# Altium project AA_CHRISTMAS_TREE.PrjPcb
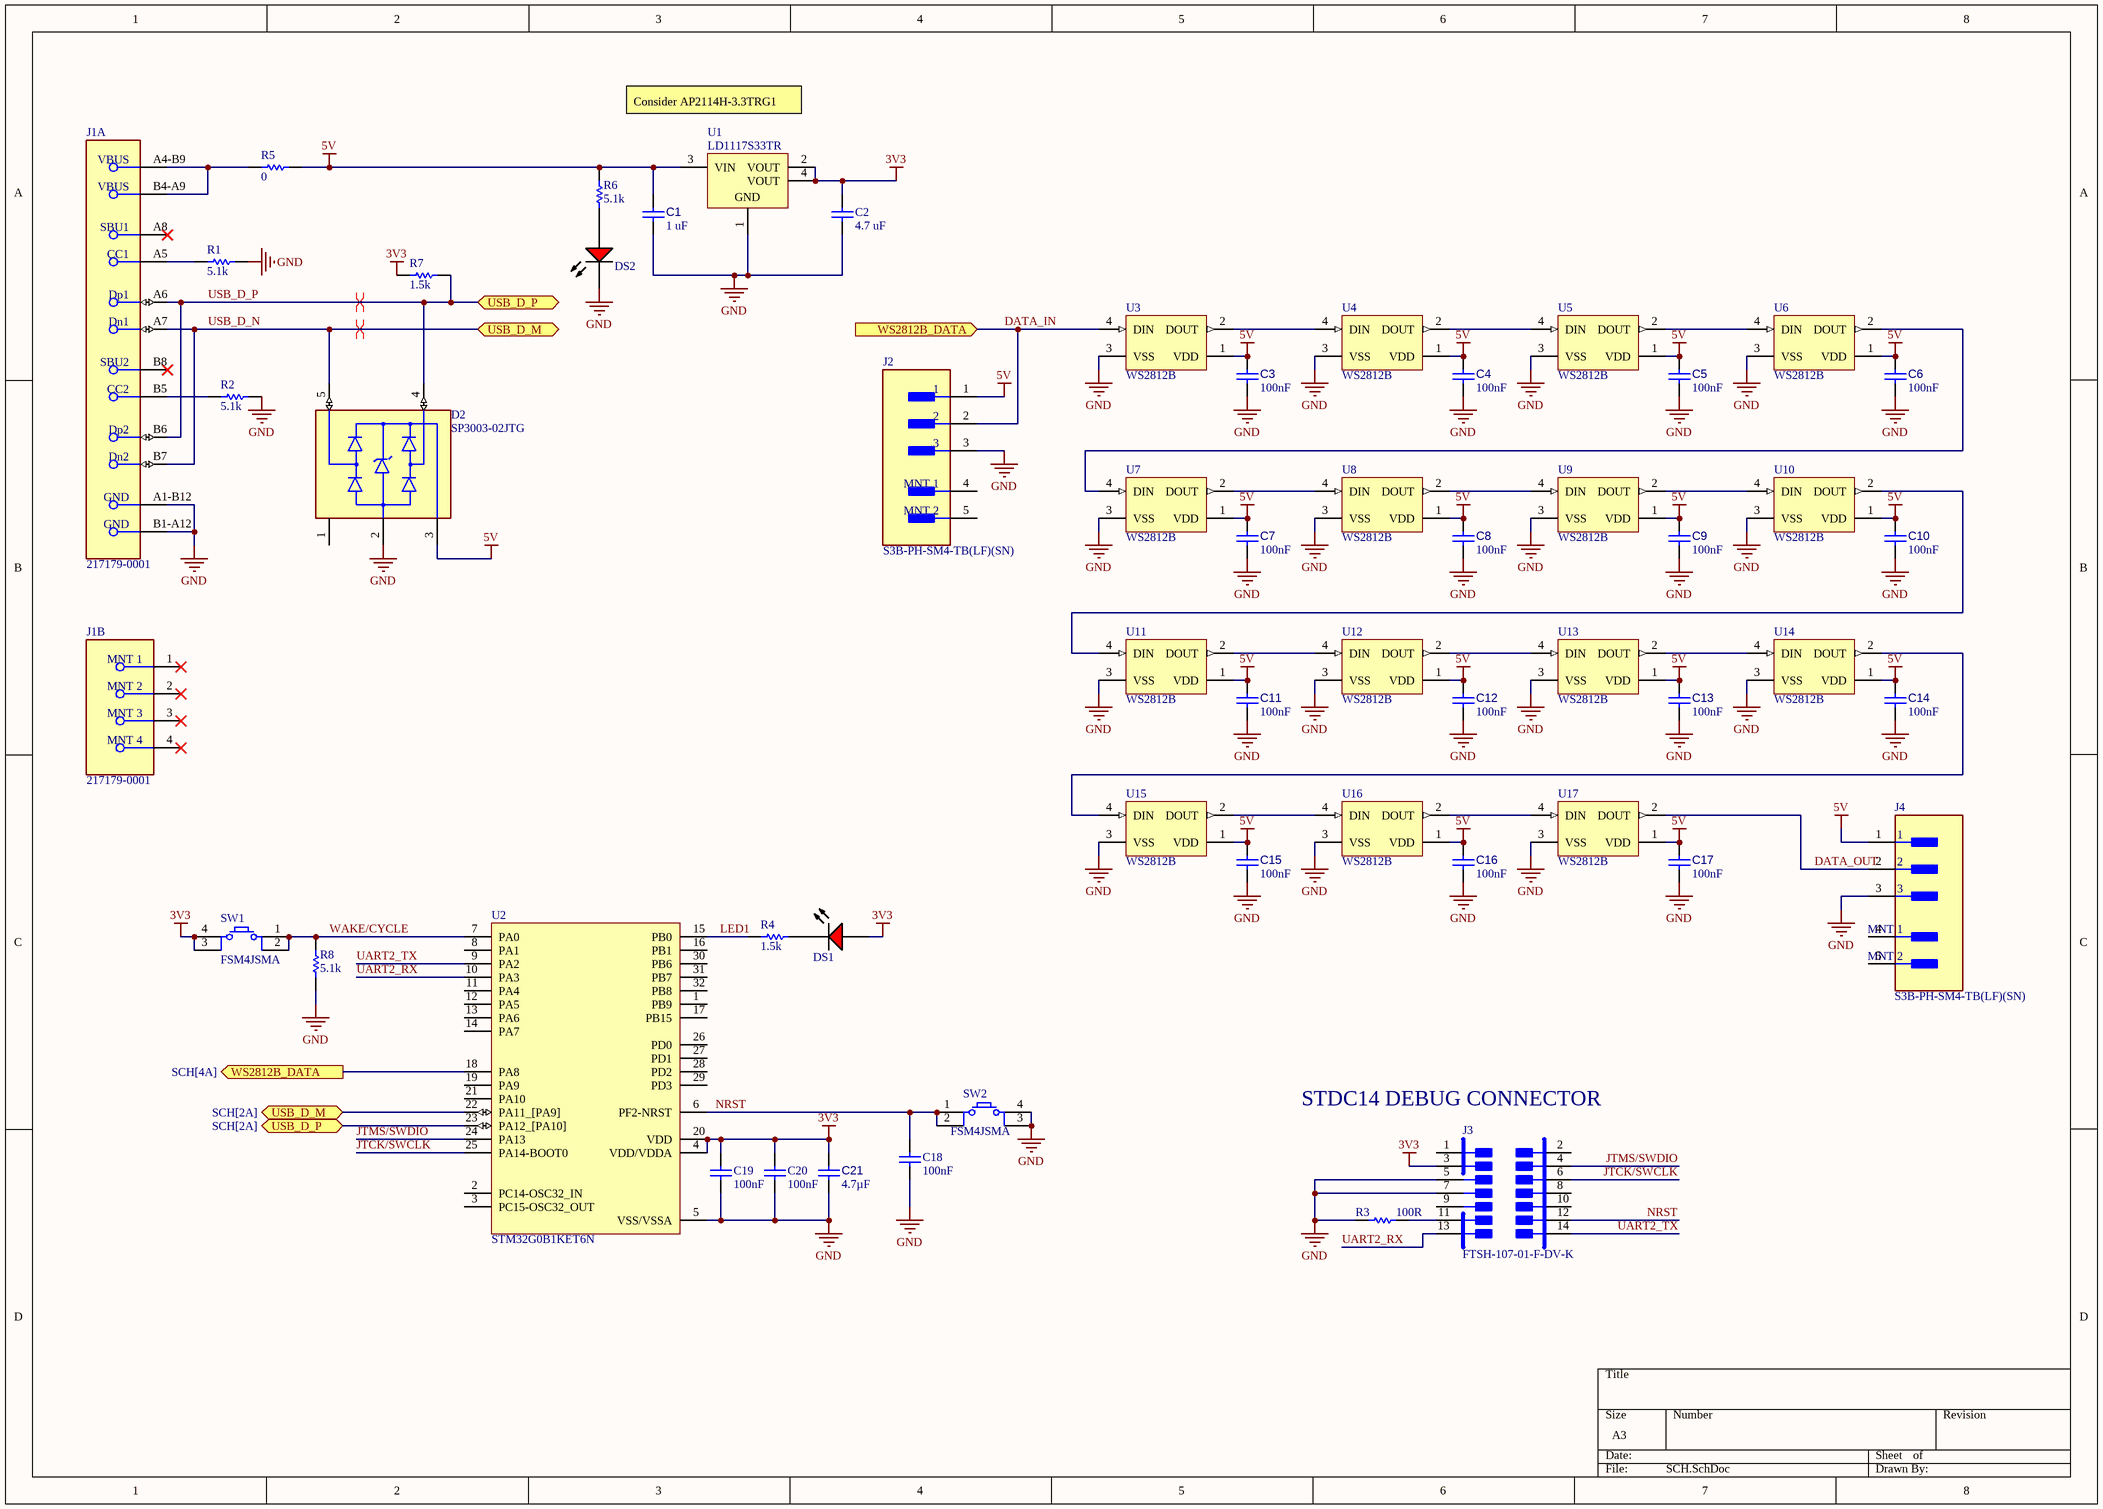
[diagram p0: SCH.SchDoc]
1 sheet, 55 parts. Net scope: flat (ports and power ports of the same name join across sheets).
Board file: PCB.PcbDoc

## Sheet SCH.SchDoc
size A3; SheetNumber: 1; SheetTotal: 1

### Parts
C1  value 1 uF  [CAPC3216X19M]  (hidden comment: Capacitor 1 uF +/-10% 100V 1206)
C2  value 4.7 uF  [CAPC3216X19M]  (hidden comment: Capacitor 4.7 uF +/-10% 50V 1206)
C3  value 100nF  [CAPC1609X09M]  (hidden comment: Capacitor 0.1 uF 10 % 50V 0603)
C4  value 100nF  [CAPC1609X09M]  (hidden comment: Capacitor 0.1 uF 10 % 50V 0603)
C5  value 100nF  [CAPC1609X09M]  (hidden comment: Capacitor 0.1 uF 10 % 50V 0603)
C6  value 100nF  [CAPC1609X09M]  (hidden comment: Capacitor 0.1 uF 10 % 50V 0603)
C7  value 100nF  [CAPC1609X09M]  (hidden comment: Capacitor 0.1 uF 10 % 50V 0603)
C8  value 100nF  [CAPC1609X09M]  (hidden comment: Capacitor 0.1 uF 10 % 50V 0603)
C9  value 100nF  [CAPC1609X09M]  (hidden comment: Capacitor 0.1 uF 10 % 50V 0603)
C10  value 100nF  [CAPC1609X09M]  (hidden comment: Capacitor 0.1 uF 10 % 50V 0603)
C11  value 100nF  [CAPC1609X09M]  (hidden comment: Capacitor 0.1 uF 10 % 50V 0603)
C12  value 100nF  [CAPC1609X09M]  (hidden comment: Capacitor 0.1 uF 10 % 50V 0603)
C13  value 100nF  [CAPC1609X09M]  (hidden comment: Capacitor 0.1 uF 10 % 50V 0603)
C14  value 100nF  [CAPC1609X09M]  (hidden comment: Capacitor 0.1 uF 10 % 50V 0603)
C15  value 100nF  [CAPC1609X09M]  (hidden comment: Capacitor 0.1 uF 10 % 50V 0603)
C16  value 100nF  [CAPC1609X09M]  (hidden comment: Capacitor 0.1 uF 10 % 50V 0603)
C17  value 100nF  [CAPC1609X09M]  (hidden comment: Capacitor 0.1 uF 10 % 50V 0603)
C18  value 100nF  [CAPC1609X09M]  (hidden comment: Capacitor 0.1 uF 10 % 50V 0603)
C19  value 100nF  [CAPC1609X09M]  (hidden comment: Capacitor 0.1 uF 10 % 50V 0603)
C20  value 100nF  [CAPC1609X09M]  (hidden comment: Capacitor 0.1 uF 10 % 50V 0603)
C21  value 4.7µF  [CAPC1609X09M]  (hidden comment: Capacitor 4.7 uF 10 % 35V 0603)
D2  SP3003-02JTG  [FP-SP3003-02JTG-MFG]
DS1  19-217/R6C-AL1M2VY/3T  [EVRL-0603-2_V]  (value not drawn)
DS2  19-217/R6C-AL1M2VY/3T  [EVRL-0603-2_V]  (value not drawn)
J1  217179-0001  [FP-2171790001-MFG]  (parts A,B of 2)
J2  S3B-PH-SM4-TB(LF)(SN)  [FP-S3B-PH-SM4-TB_LF_SN-MFG]
J3  FTSH-107-01-F-DV-K  [FP-FTSH-107-01-F-DV-K-MFG]
J4  S3B-PH-SM4-TB(LF)(SN)  [FP-S3B-PH-SM4-TB_LF_SN-MFG]
R1  value 5.1k  [RESC1608X55X25ML10T15]  (hidden comment: 5K1 1 0603)
R2  value 5.1k  [RESC1608X55X25ML10T15]  (hidden comment: 5K1 1 0603)
R3  value 100R  [RESC1608X55X25ML10T15]  (hidden comment: 100R 1 0603)
R4  value 1.5k  [RESC1608X55X25ML10T15]  (hidden comment: 1K5 1 0603)
R5  value 0  [RESC3116X70X50ML13T20]  (hidden comment: Jumper 1206)
R6  value 5.1k  [RESC1608X55X25ML10T15]  (hidden comment: 5K1 1 0603)
R7  value 1.5k  [RESC1608X55X25ML10T15]  (hidden comment: 1K5 1 0603)
R8  value 5.1k  [RESC1608X55X25ML10T15]  (hidden comment: 5K1 1 0603)
SW1  FSM4JSMA  [TECO-FSM4JSMA_V]
SW2  FSM4JSMA  [TECO-FSM4JSMA_V]
U1  LD1117S33TR  [STM-SOT-223_M]
U2  STM32G0B1KET6N  [STM32G0B1KET6N-Footprint-1]
U3  WS2812B  [ADAI-WS2812B_V]
U4  WS2812B  [ADAI-WS2812B_V]
U5  WS2812B  [ADAI-WS2812B_V]
U6  WS2812B  [ADAI-WS2812B_V]
U7  WS2812B  [ADAI-WS2812B_V]
U8  WS2812B  [ADAI-WS2812B_V]
U9  WS2812B  [ADAI-WS2812B_V]
U10  WS2812B  [ADAI-WS2812B_V]
U11  WS2812B  [ADAI-WS2812B_V]
U12  WS2812B  [ADAI-WS2812B_V]
U13  WS2812B  [ADAI-WS2812B_V]
U14  WS2812B  [ADAI-WS2812B_V]
U15  WS2812B  [ADAI-WS2812B_V]
U16  WS2812B  [ADAI-WS2812B_V]
U17  WS2812B  [ADAI-WS2812B_V]

### Ports
USB_D_M (bidir, see SCH[1C]), USB_D_M (bidir, see SCH[2A]), USB_D_P (bidir, see SCH[1C]), USB_D_P (bidir, see SCH[2A]), WS2812B_DATA (in, see SCH[1C]), WS2812B_DATA (out, see SCH[4A])

### Nets
3V3: C2.2 C19.1 C20.1 C21.2 DS1.1(A) J3.3 R7.2 SW1.3 SW1.4 U1.2(VOUT) U1.4(VOUT) U2.4(VDD/VDDA) U2.20(VDD)
5V: C1.2 C3.2 C4.2 C5.2 C6.2 C7.2 C8.2 C9.2 C10.2 C11.2 C12.2 C13.2 C14.2 C15.2 C16.2 C17.2 D2.3(VCC) J2.1 J4.1 R5.2 R6.1 U1.3(VIN) U3.1(VDD) U4.1(VDD) U5.1(VDD) U6.1(VDD) U7.1(VDD) U8.1(VDD) U9.1(VDD) U10.1(VDD) U11.1(VDD) U12.1(VDD) U13.1(VDD) U14.1(VDD) U15.1(VDD) U16.1(VDD) U17.1(VDD)
GND: C1.1 C2.1 C3.1 C4.1 C5.1 C6.1 C7.1 C8.1 C9.1 C10.1 C11.1 C12.1 C13.1 C14.1 C15.1 C16.1 C17.1 C18.1 C19.2 C20.2 C21.1 D2.2(GND) DS2.2(K) J1.A1-B12(GND) J1.B1-A12(GND) J2.3 J3.5 J3.7 J4.3 R1.1 R2.2 R3.1 R8.2 SW2.3 SW2.4 U1.1(GND) U2.5(VSS/VSSA) U3.3(VSS) U4.3(VSS) U5.3(VSS) U6.3(VSS) U7.3(VSS) U8.3(VSS) U9.3(VSS) U10.3(VSS) U11.3(VSS) U12.3(VSS) U13.3(VSS) U14.3(VSS) U15.3(VSS) U16.3(VSS) U17.3(VSS)
DATA_IN: J2.2 U2.18(PA8) U3.4(DIN) ; port WS2812B_DATA
DATA_OUT: J4.2 U17.2(DOUT)
JTCK/SWCLK: J3.6 U2.25(PA14-BOOT0)
JTMS/SWDIO: J3.4 U2.24(PA13)
LED1: R4.2 U2.15(PB0)
NRST: C18.2 J3.12 SW2.1 SW2.2 U2.6(PF2-NRST)
UART2_RX: J3.13 U2.10(PA3)
UART2_TX: J3.14 U2.9(PA2)
USB_D_N: D2.5(I/O1) J1.A7(Dn1) J1.B7(Dn2) U2.22(PA11_[PA9]) ; port USB_D_M
USB_D_P: D2.4(I/O2) J1.A6(Dp1) J1.B6(Dp2) R7.1 U2.23(PA12_[PA10]) ; port USB_D_P
WAKE/CYCLE: R8.1 SW1.1 SW1.2 U2.7(PA0)
NetDS1_2: DS1.2(K) R4.1
NetDS2_1: DS2.1(A) R6.2
NetJ1_A4-B9: J1.A4-B9(VBUS) J1.B4-A9(VBUS) R5.1
NetJ1_A5: J1.A5(CC1) R1.2
NetJ1_B5: J1.B5(CC2) R2.1
NetJ3_11: J3.11 R3.2
NetU3_2: U3.2(DOUT) U4.4(DIN)
NetU4_2: U4.2(DOUT) U5.4(DIN)
NetU5_2: U5.2(DOUT) U6.4(DIN)
NetU6_2: U6.2(DOUT) U7.4(DIN)
NetU7_2: U7.2(DOUT) U8.4(DIN)
NetU8_2: U8.2(DOUT) U9.4(DIN)
NetU9_2: U9.2(DOUT) U10.4(DIN)
NetU10_2: U10.2(DOUT) U11.4(DIN)
NetU11_2: U11.2(DOUT) U12.4(DIN)
NetU12_2: U12.2(DOUT) U13.4(DIN)
NetU13_2: U13.2(DOUT) U14.4(DIN)
NetU14_2: U14.2(DOUT) U15.4(DIN)
NetU15_2: U15.2(DOUT) U16.4(DIN)
NetU16_2: U16.2(DOUT) U17.4(DIN)

Not connected (* = marked no-connect by the designer): D2 1(NC); J1 1(MNT_1)* 2(MNT_2)* 3(MNT_3)* 4(MNT_4)* A8(SBU1)* B8(SBU2)*; J2 4(MNT_1) 5(MNT_2); J3 1 2 8 9 10; J4 4(MNT_1) 5(MNT_2); U2 1(PB9) 2(PC14-OSC32_IN) 3(PC15-OSC32_OUT) 8(PA1) 11(PA4) 12(PA5) 13(PA6) 14(PA7) 16(PB1) 17(PB15) 19(PA9) 21(PA10) 26(PD0) 27(PD1) 28(PD2) 29(PD3) 30(PB6) 31(PB7) 32(PB8)

### Layout directives
differential pair: USB_D_N, USB_D_P

### Notes on the sheet
- Consider AP2114H-3.3TRG1
- (near J3) STDC14 DEBUG CONNECTOR

### Library data of the parts
C1 = CMP-001-01157-1: CAP CER 1UF 100V X7R 1206; Capacitor Type: Ceramic; Tolerance: +/-10%; RoHS Compliant: Yes; Voltage Rating: 100V; Case/Package: 1206; Component Type: Surface Mount; Mounting Technology: Surface Mount
C2 = CMP-001-01179-1: CAP CER 4.7UF 50V X7R 1206; Capacitor Type: Ceramic; Case/Package: 1206; Component Type: Surface Mount; Tolerance: +/-10%; Voltage Rating: 50V; Mounting Technology: Surface Mount; RoHS Compliant: Yes
C3-C20 = CMP-001-00092-2: CAP CER 0.1UF 50V X7R 0603; Tolerance: 10%; Capacitor Type: Ceramic; Voltage Rating: 50V; Case/Package: 0603
C21 = CMP-001-00124-1: CAP CER 4.7UF 35V X5R 0603; Capacitor Type: Ceramic; Tolerance: 10%; Case/Package: 0603; Voltage Rating: 35V
D2 = CMP-08607-000046-1: TVS DIODE 6V 15V SC70-5; Manufacturer: Littelfuse; Number Of Channels: 2; Capacitance: 0.65pF; Automotive Grade: Grade 1; Value: 0.65pF; Direction: Bidirectional; Clamping Voltage: 11.8V; Peak Pulse Current: 2.5A; Standoff Height: 0mm; Temperature Range High: +125°C; Device Class L3: unset; Automotive: Yes; Temperature: -40°C to +125°C; Reverse Standoff Voltage: 6V; Ipc Land Pattern Name: SOT65P220X95-5; Temperature Range Low: -40°C; RoHS: TRUE; Category: Diode; ComponentLink2Description: Datasheet; Package: 0; Device Class L2: TVS Diodes; Lead Free: Yes; Mouser Description: TVS Diodes / ESD Suppressors 2 Ch 8kV 0.65pF SPA; Manufacturer Part Number: SP3003-02JTG; Digikey Description: TVS DIODE 6V 15V SC70-5; Octopart: https://octopart.com/sp3003-02jtg-littelfuse-11540566; Device Class L1: Circuit Protection; ComponentLink2URL: https://www.littelfuse.com/~/media/electronics/datasheets/tvs_diode_arrays/littelfuse_tvs_diode_array_sp3003_datasheet.pdf.pdf; Height: 1.1mm
DS1 DS2 = CMP-007-00004-2: Chip LED, Red, 5 V, 25 mA, -40 to 85 degC, 2-Pin SMD (0603), RoHS, Tape and Reel; Manufacturer: Everlight Electronics; Forward Voltage: 2.2V; Lens Style: Clear; Package Reference: 0603; Datasheet Version: Rev. 1, 01/2005; Mounting Technology: SM; RoHS Compliant: False; Datasheet URL: https://datasheet.ciiva.com/4688/el-19-217-r6c-al1m2vy-3tpdf-187026-4688713.pdf; Case/Package: 0603; Colour: Red; Manufacturer URL: http://www.everlight.com/; Package Description: 2-Pin Surface Mount Device, Body 1.6 x 0.8 mm
J1 = CMP-04767-000028-2: CONN RCP USB2.0 TYP C 24P SMD RA; NexarPartId: 117190526; Gender: Receptacle; Number of Contacts: 16; Current Rating: 1.25A; Voltage Rating: 30V; Min Operating Temperature: -40°C; USB Standard: USB 2.0; Height: 3.36mm; Contact Material: Gold, Nickel; Max Operating Temperature: 85°C
J2 J4 = CMP-2000-07023-2: CONN HEADER SMD R/A 3POS 2MM; Voltage Rating: 100V; Gender: Male; Max Current Rating: 2A; Number of Contacts: 3; Insulation Resistance: 1GR; Contact Resistance: 10mR; Termination: Solder; Orientation: Right Angle; Insulation Color: Natural; Flammability Rating: UL94 V-0; Width: 5mm; Lead Free: Lead Free; Mount: Surface Mount; Max Operating Temperature: 85°C; Connector Type: Header; Fastening Type: Detent; Max Voltage Rating (DC): 100V; Housing Material: Polyamide; Number of Rows: 1; Housing Color: Beige; Contact Plating: Tin; Contact Shape: Square; Working Voltage: 100V; Contact Material: Copper Alloy; Contact Mating Length: 0.13inch; Contact Type: Male Pin; Max Voltage Rating (AC): 100V; Packaging: Tape and Reel; Min Operating Temperature: -25°C; Number of Positions: 3; REACH SVHC: No SVHC; Contact Finish - Mating: TIN; Color: Natural; Length: 9.9mm; Insulation Material: Nylon; Depth: 7.6mm; Current Rating: 2A; Material: Polyamide; Voltage Rating (AC): 100V; Pitch: 2mm; Series: PH; Height: 9.4mm; Number of Poles: 3; Lead Pitch: 2mm
J3 = CMP-002-00095-3: Board Connector, 14 Contact(s), 2 Row(s), Male, Straight, 0.05 inch Pitch, Surface Mount Terminal, Locking; RoHS Compliant: Yes; Connector Type: BOARD CONNECTOR; Mounting Technology: Board
R1 R2 R6 R8 = CMP-0103-0600-4: 0603 (1608 Metric) 1/10 W 5K1 1 Thick Film Chip Resistor; Case-Metric: 1608; Tolerance: 1%; Temp. Coefficent: ±100; Power: 100mW; Case-EIA: 0603; Technology: SMT
R3 = CMP-0103-0559-4: 0603 (1608 Metric) 1/10 W 100R 1 Thick Film Chip Resistor; Power: 100mW; Temp. Coefficent: ±100; Tolerance: 1%; Case-Metric: 1608; Case-EIA: 0603; Technology: SMT
R4 R7 = CMP-0103-0587-4: 0603 (1608 Metric) 1/10 W 1K5 1 Thick Film Chip Resistor; Tolerance: 1%; Case-Metric: 1608; Power: 100mW; Temp. Coefficent: ±100; Case-EIA: 0603; Technology: SMT
R5 = CMP-0105-0510-4: Jumper 1206 (3216 Metric); Case-EIA: 1206; Temp. Coefficent: None; Power: 250mW; Case-Metric: 3216; Tolerance: 0%; Technology: SMT
SW1 SW2 = CMP-00028-00007-2: Switch Tactile OFF (ON) SPST Round Button Gull Wing 0.05A 12VDC 1.57N SMD Loose Piece; Voltage Rating: 24V; Max Current Rating: 50mA; Case/Package: SMD/SMT; Mounting Technology: Surface Mount
U1 = CMP-019-00019-3: Low Drop Positive Voltage Regulator, 800 mA, Fixed 3.3 V Output, 0 to 125 degC, 3-Pin TO-220, RoHS, Tape and Reel; Manufacturer: STMicroelectronics; Max Supply Voltage: 15V; Dropout Voltage: 1.1V; Power: 12W; Output Current: 950mA; Min Input Voltage: 4.75V; Nominal Output Voltage: 3.3V; Max Ouput Current: 1.3A; Outputs: 1; Packaging: TapeandReel; Datasheet Version: Rev. 33, 11/2013; RoHS Compliant: True; Mounting Technology: SM; Max Input Voltage: 15V; Max Operating Temperature: 125°C; Package Reference: SOT-223; Package Quantity: 2500; Package Description: 4-Pin Small Outline Transistor, Body 6.5 x 3.5 mm, Pitch 2.3 mm; Case/Package: TO-261-4; Min Operating Temperature: 0°C; Datasheet URL: http://www.farnell.com/datasheets/1776449.pdf; Min Supply Voltage: 4.75V; Pins: 3; Output Voltage: 3.3V; Manufacturer URL: http://www.st.com/
U2 = CMP-020-00025-3: RISC Microcontroller, 32-Bit, FLASH, Cortex-M0+ CPU, 64MHz, CMOS, PQFP32
U3-U17 = CMP-007-00035-2: Intelligent Control LED Integrated Light Source, 3.5 to 5.3 V, -25 to 80 degC, 4-Pin SMD, RoHS, Bulk; Manufacturer: Adafruit Industries; Datasheet URL: https://cdn-shop.adafruit.com/datasheets/WS2812B.pdf; Manufacturer URL: https://www.adafruit.com/; Datasheet Version: May-13; Case/Package: WS2812B; Mounting Technology: SM; RoHS Compliant: False; Package Description: 4-Pin Surface Mount Device, Body 5 x 5 mm, Pitch 3.3 mm; Package Reference: WS2812B